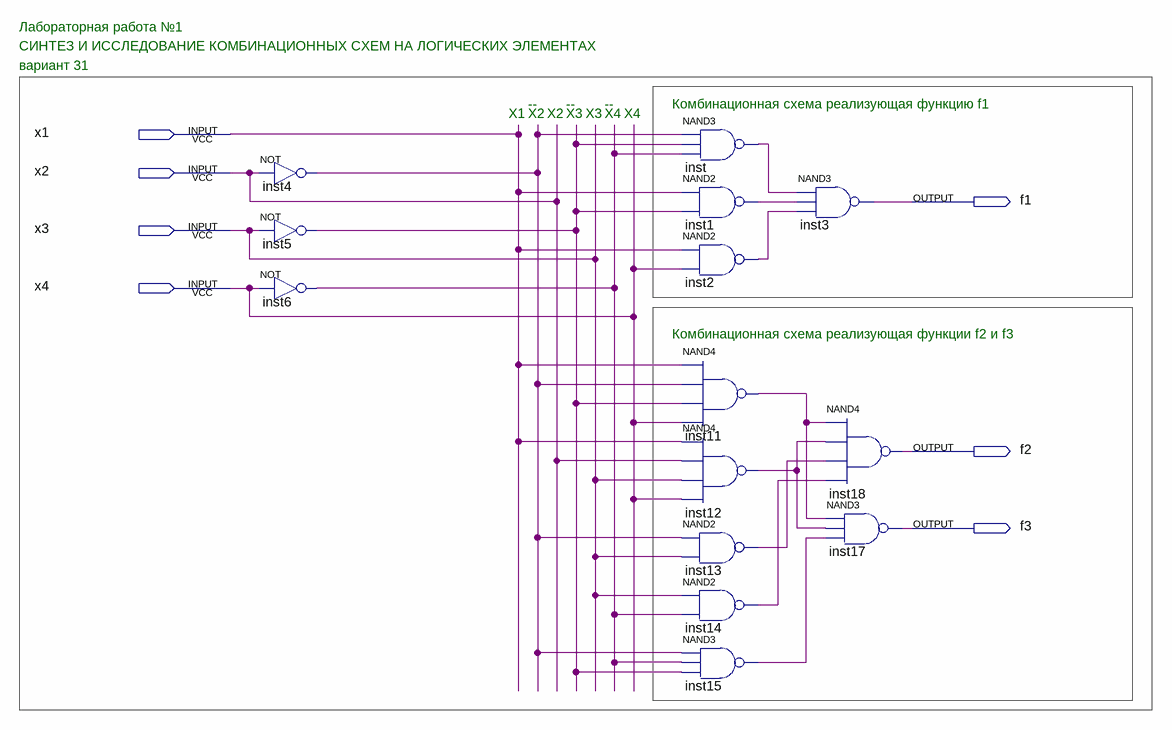
[diagram p0: schematic sheet]
// Quartus schematic Shema.bdf as structural Verilog: 14 symbols, 7 pins
module Shema (
  input  x1,
  input  x2,
  input  x3,
  input  x4,
  output f1,
  output f2,
  output f3
);

  wire inst1_out, inst2_out, inst4_out, inst5_out, inst6_out, inst11_out, inst12_out, inst13_out, inst14_out,
       inst15_out, inst_out;

  not inst4 (inst4_out, x2);
  not inst5 (inst5_out, x3);
  not inst6 (inst6_out, x4);
  nand inst (inst_out, inst4_out, inst5_out, inst6_out);
  nand inst1 (inst1_out, x1, inst5_out);
  nand inst2 (inst2_out, x1, x4);
  nand inst11 (inst11_out, x1, inst4_out, inst5_out, x4);
  nand inst12 (inst12_out, x1, x2, x3, x4);
  nand inst13 (inst13_out, inst4_out, x3);
  nand inst14 (inst14_out, x3, inst6_out);
  nand inst15 (inst15_out, inst4_out, inst6_out, inst5_out);
  nand inst3 (f1, inst_out, inst1_out, inst2_out);
  nand inst18 (f2, inst11_out, inst12_out, inst13_out, inst14_out);
  nand inst17 (f3, inst11_out, inst12_out, inst15_out);

  // Notes on the sheet:
  //   Лабораторная работа №1
  //   СИНТЕЗ И ИССЛЕДОВАНИЕ КОМБИНАЦИОННЫХ СХЕМ НА ЛОГИЧЕСКИХ ЭЛЕМЕНТАХ
  //   вариант 31
  //   --
  //   --
  //   --
  //   Комбинационная схема реализующая функцию f1
  //   X1
  //   X2
  //   X2
  //   X3
  //   X3
  //   X4
  //   X4
  //   Комбинационная схема реализующая функции f2 и f3
endmodule
